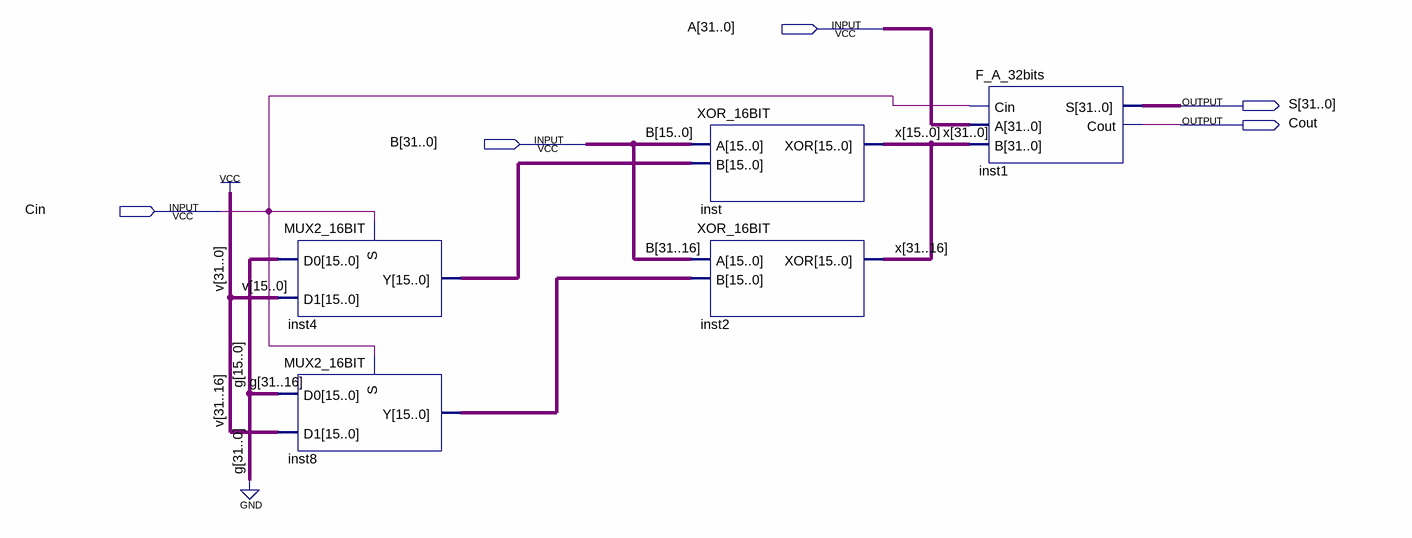
[diagram p0: schematic sheet]
// Quartus schematic ADD_SUB_32bits.bdf as structural Verilog: 5 symbols, 5 pins
module ADD_SUB_32bits (
  input  [31:0] A,
  input  [31:0] B,
  input  Cin,
  output [31:0] S,
  output Cout
);

  wire [15:0] inst4_y, inst8_y;
  wire [31:0] x;

  MUX2_16BIT inst4 (.S(Cin), .D1({16{1'b1}}), .D0({16{1'b0}}), .Y(inst4_y));
  MUX2_16BIT inst8 (.S(Cin), .D1({16{1'b1}}), .D0({16{1'b0}}), .Y(inst8_y));
  XOR_16BIT inst (.A(B[15:0]), .B(inst4_y), .XOR(x[15:0]));
  XOR_16BIT inst2 (.A(B[31:16]), .B(inst8_y), .XOR(x[31:16]));
  F_A_32bits inst1 (.Cin(Cin), .A(A), .B(x), .S(S), .Cout(Cout));
endmodule
